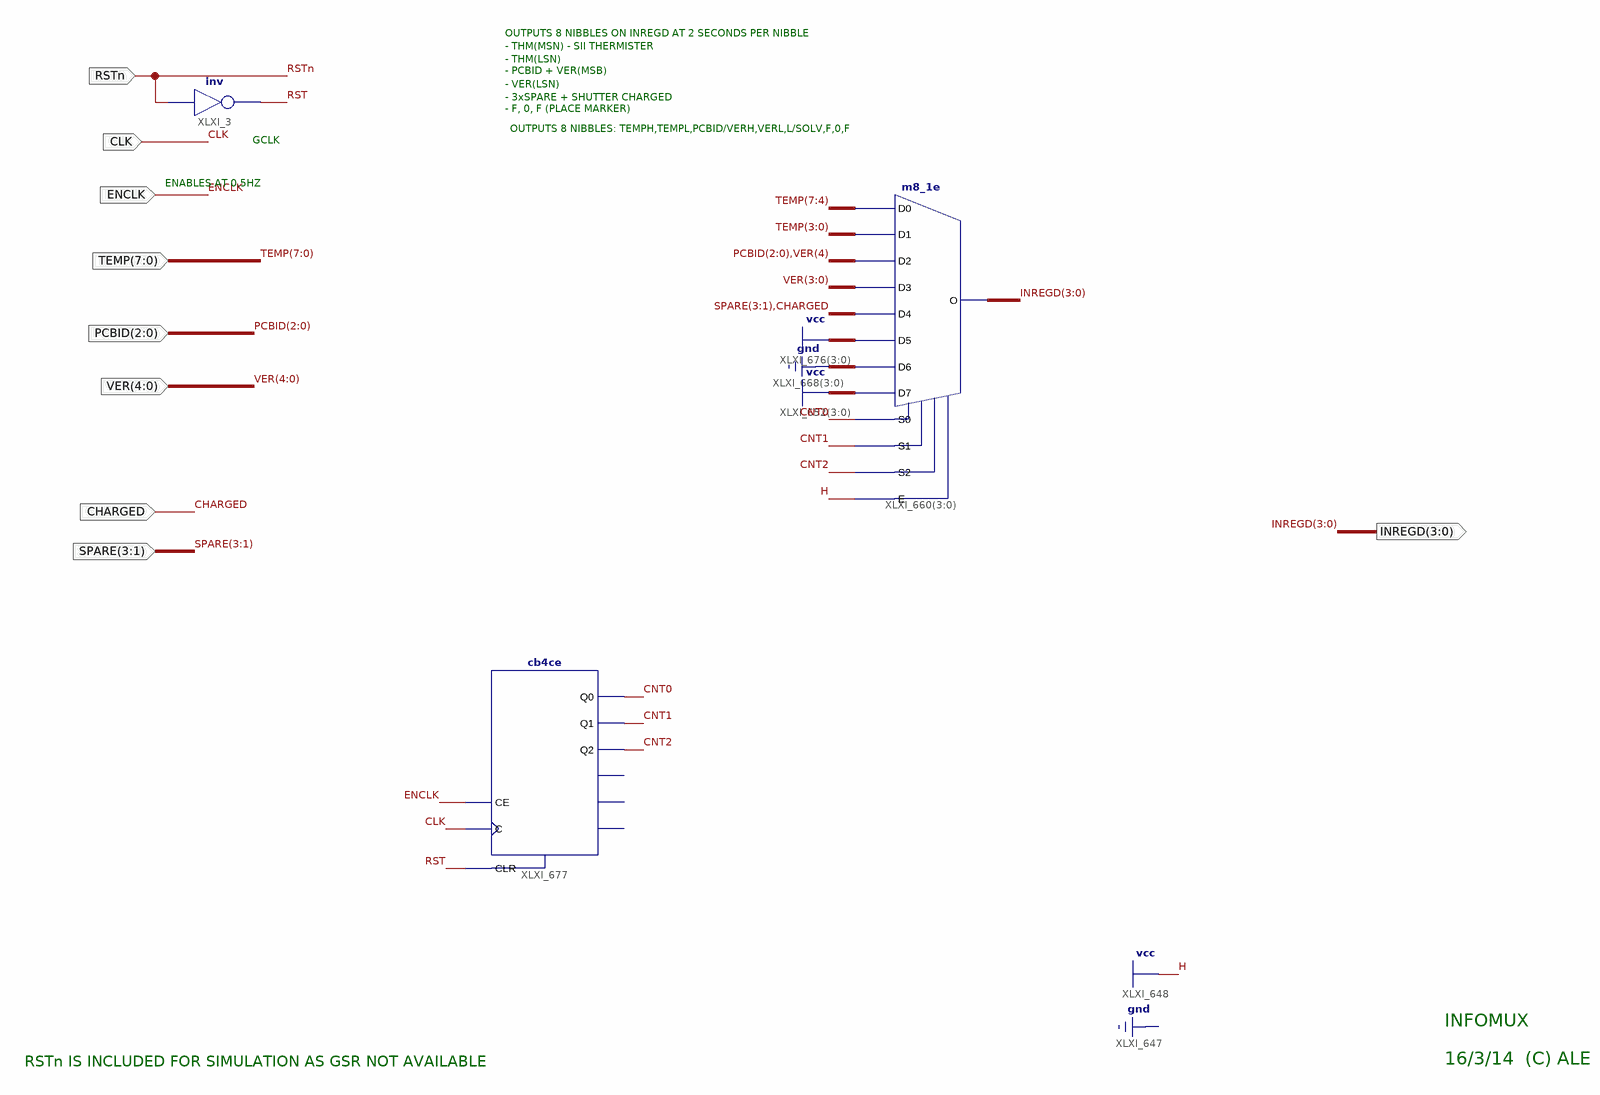
[diagram p0: schematic sheet 1]
// Xilinx ISE schematic DB_InfoMux.sch (spartan3e) as structural Verilog: 3 symbols, 9 ports
module DB_InfoMux (
  input  RSTn,
  input  [7:0] TEMP,
  input  CHARGED,
  input  [2:0] PCBID,
  input  [4:0] VER,
  input  CLK,
  input  ENCLK,
  input  [3:1] SPARE,
  output [3:0] INREGD
);

  wire CNT0, CNT1, CNT2, RST;

  not XLXI_3 (RST, RSTn);
  m8_1e XLXI_660[3:0] (
    .D0(TEMP[7:4]), .D1(TEMP[3:0]), .D2({PCBID, VER[4]}), .D3(VER[3:0]), .D4({SPARE, CHARGED}), .D5(4'b1111),
    .D6(4'b0000), .D7(4'b1111), .E(1'b1), .S0(CNT0), .S1(CNT1), .S2(CNT2), .O(INREGD));
  cb4ce XLXI_677 (.C(CLK), .CE(ENCLK), .CLR(RST), .Q0(CNT0), .Q1(CNT1), .Q2(CNT2));  // open: CEO, Q3, TC

  // Notes on the sheet:
  //   OUTPUTS 8 NIBBLES ON INREGD AT 2 SECONDS PER NIBBLE
  //   - THM(MSN) - SII THERMISTER
  //   - THM(LSN)
  //   - PCBID + VER(MSB)
  //   - VER(LSN)
  //   - 3xSPARE + SHUTTER CHARGED
  //   - F, 0, F (PLACE MARKER)
  //   OUTPUTS 8 NIBBLES: TEMPH,TEMPL,PCBID/VERH,VERL,L/SOLV,F,0,F
  //   GCLK
  //   ENABLES AT 0.5HZ
  //   INFOMUX
  //   16/3/14  (C) ALE
  //   RSTn IS INCLUDED FOR SIMULATION AS GSR NOT AVAILABLE
endmodule
